# EAGLE design SPARC Project Gamma_Schematic (EAGLE 9.6.2)
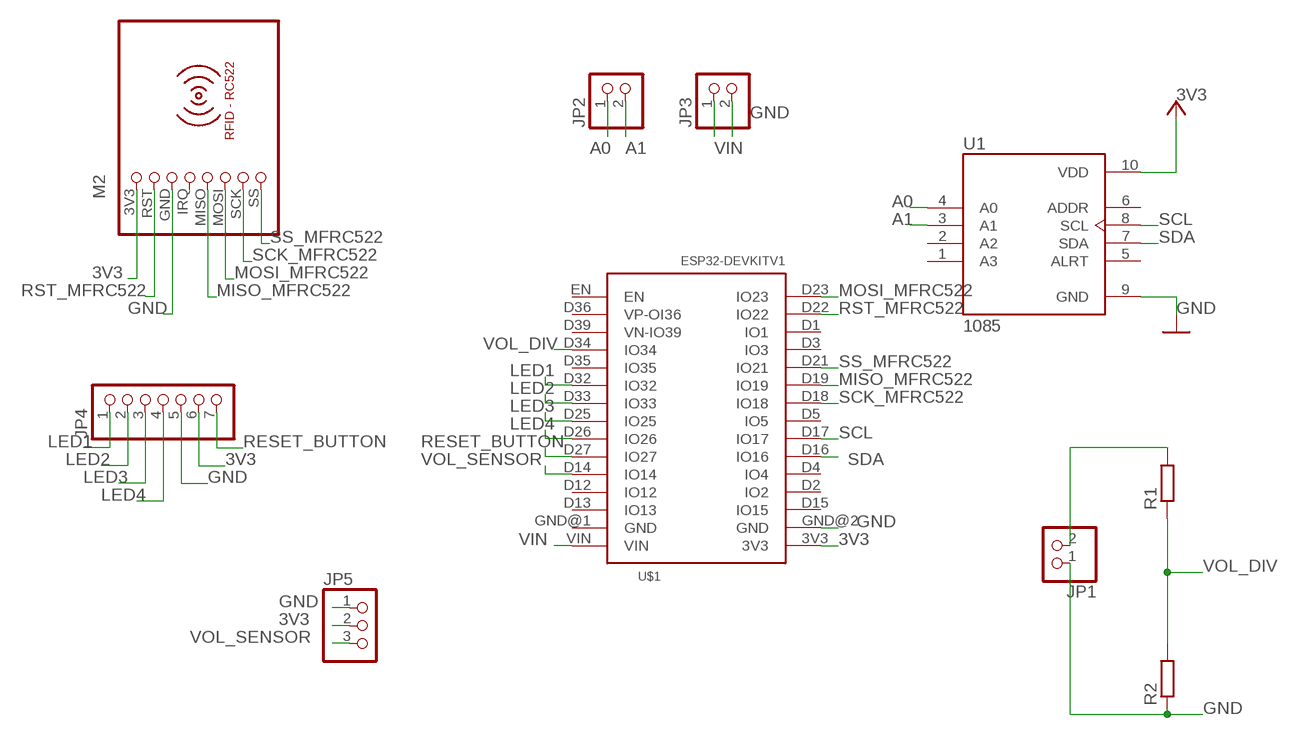
[diagram p0: schematic, sheet 1]

## Parts
JP1  PINHD-1X2  [1X02]
JP2  PINHD-1X2  [1X02]
JP3  PINHD-1X2  [1X02]
JP4  PINHD-1X7  [1X07]
JP5  PINHD-1X3  [1X03]
M2  RFID-RC522  [RFID-RC522]
R1  R-EU_0204/2V  [0204V]
R2  R-EU_0204/2V  [0204V]
U1  1085  [MODULE_1085]
U$1  ESP32DEVKITV1  [ESP32-DEVKITV1]

## Nets
3V3: JP4.6 JP5.2 M2.3V3 U1.10(VDD) U$1.3V3 ; supply symbol labelled +3V3
A0: JP2.1 U1.4(A0)
A1: JP2.2 U1.3(A1)
GND: JP1.1 JP3.2 JP4.5 JP5.1 M2.GND R2.1 U1.9(GND) U$1.GND@2(GND)
LED1: JP4.1 U$1.D32(IO32)
LED2: JP4.2 U$1.D33(IO33)
LED3: JP4.3 U$1.D25(IO25)
LED4: JP4.4 U$1.D26(IO26)
MISO_MFRC522: M2.MISO U$1.D19(IO19)
MOSI_MFRC522: M2.MOSI U$1.D23(IO23)
N$1: JP1.2 R1.2
RESET_BUTTON: JP4.7 U$1.D27(IO27)
RST_MFRC522: M2.RST U$1.D22(IO22)
SCK_MFRC522: M2.SCK U$1.D18(IO18)
SCL: U1.8(SCL) U$1.D17(IO17)
SDA: U1.7(SDA) U$1.D16(IO16)
SS_MFRC522: M2.SS U$1.D21(IO21)
VIN: JP3.1 U$1.VIN
VOL_DIV: R1.1 R2.2 U$1.D34(IO34)
VOL_SENSOR: JP5.3 U$1.D14(IO14)
Unconnected: M2.IRQ U1.1(A3) U1.2(A2) U1.5(ALRT) U1.6(ADDR) U$1.D1(IO1) U$1.D2(IO2) U$1.D3(IO3) U$1.D4(IO4) U$1.D5(IO5) U$1.D12(IO12) U$1.D13(IO13) U$1.D15(IO15) U$1.D35(IO35) U$1.D36(VP-OI36) U$1.D39(VN-IO39) U$1.EN U$1.GND@1(GND)

## Library data of the parts
JP1-JP3 = pinhead:PINHD-1X2: PIN HEADER
JP4 = pinhead:PINHD-1X7: PIN HEADER
JP5 = pinhead:PINHD-1X3: PIN HEADER
M2 = mfrc522-module:RFID-RC522: RFID-RC522 MFRC-522 based breakout board
R1 R2 = resistor:R-EU_: RESISTOR, European symbol
U1 = ads1115:1085: ADS1115 - 16 Bit 860 Samples per Second Analog to Digital Converter (ADC) Evaluation Board Check availability <https://pricing.snapeda.com/parts/1085/Adafruit%20Industries/view-part?ref=eda>; AVAILABILITY: In Stock; CHECK_PRICES: https://www.snapeda.com/parts/1085/Adafruit+Industries+LLC/view-part/?ref=eda; DESCRIPTION: ADS1115 series 16 Bit 860 Samples per Second Analog to Digital Converter (ADC) Evaluation Board; MF: Adafruit Industries; MP: 1085; PACKAGE: NON STANDARD-16 Adafruit; PRICE: None; SNAPEDA_LINK: https://www.snapeda.com/parts/1085/Adafruit+Industries+LLC/view-part/?ref=snap
U$1 = ESP32-DEVKITV1:ESP32DEVKITV1

## Board
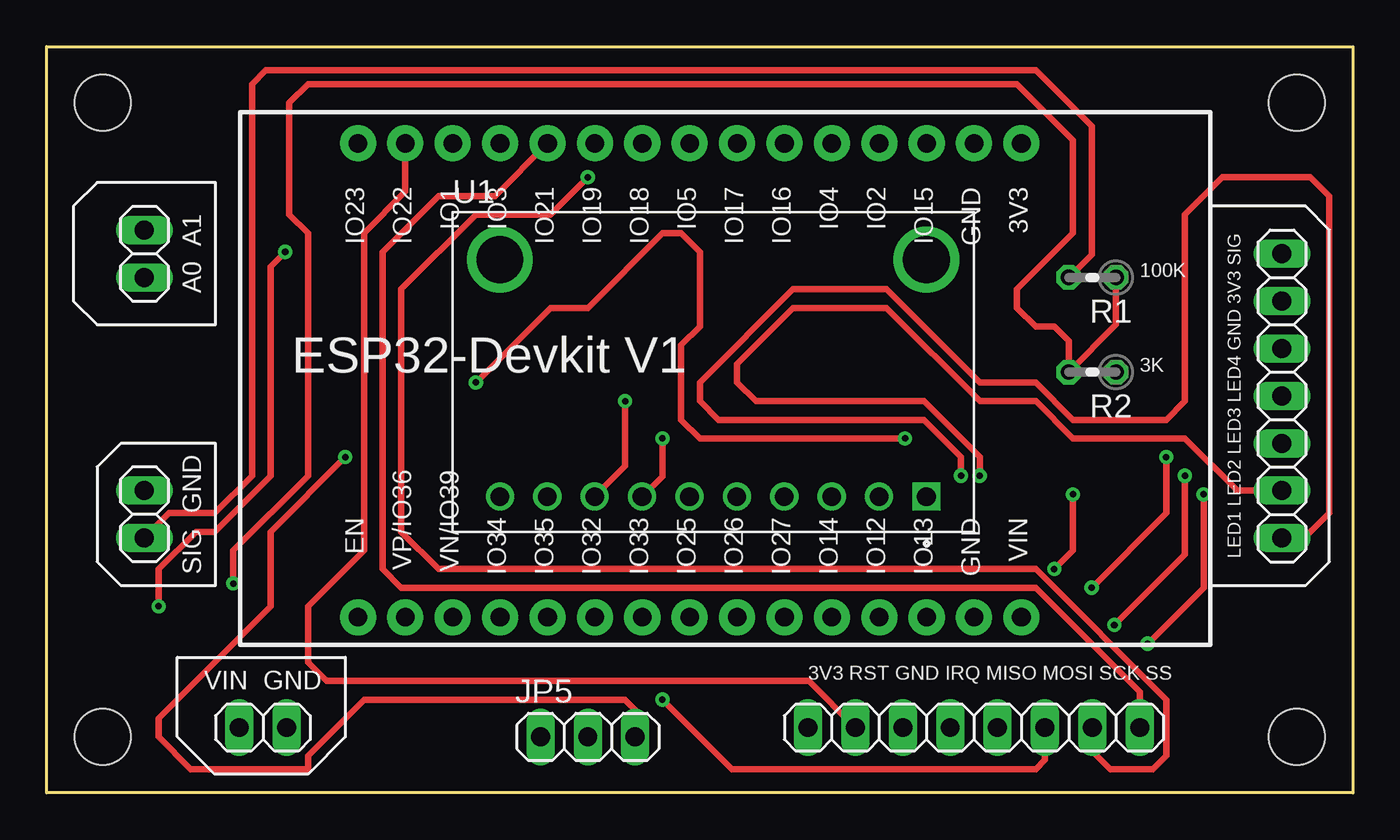
[diagram p1: board, top side]
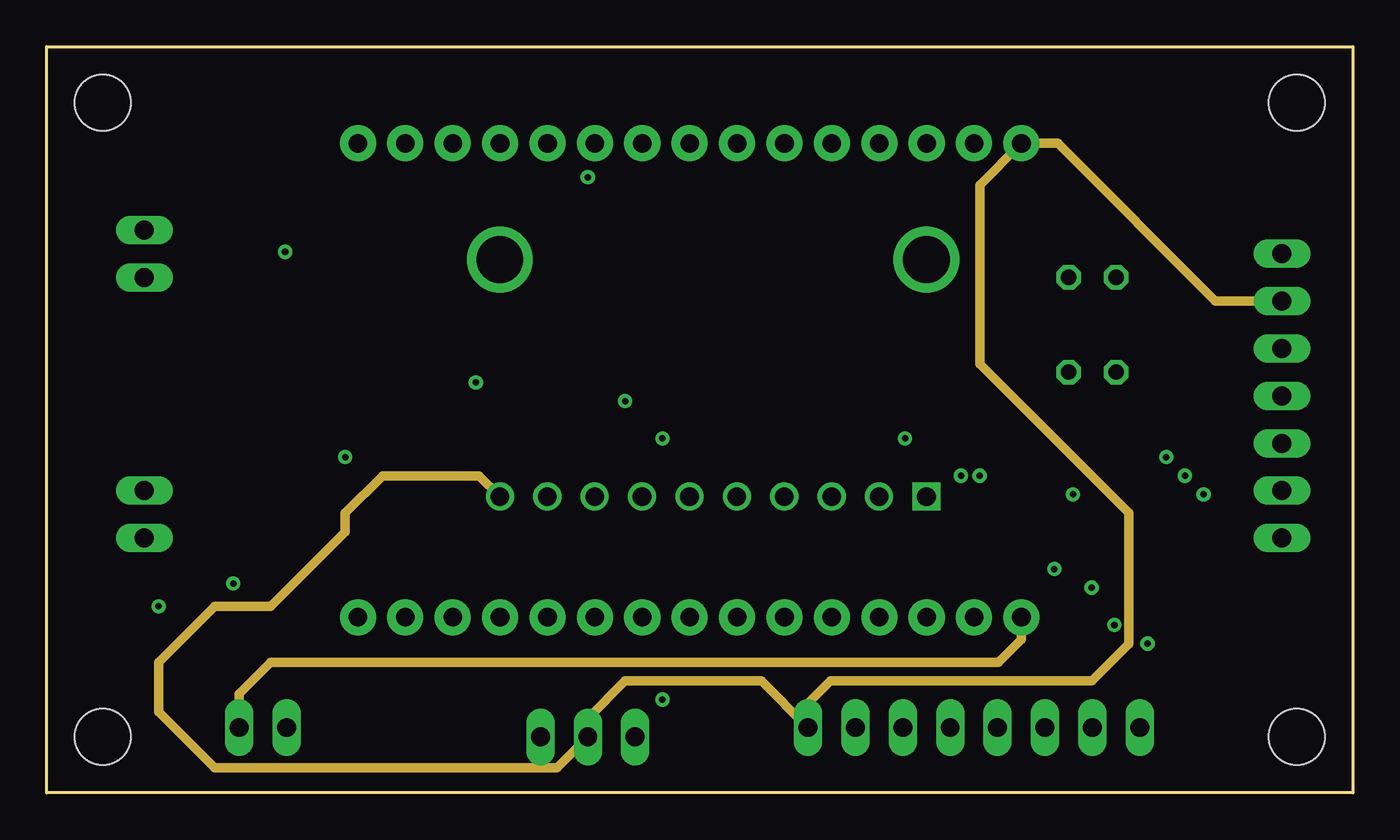
[diagram p2: board, inner layer Route2]
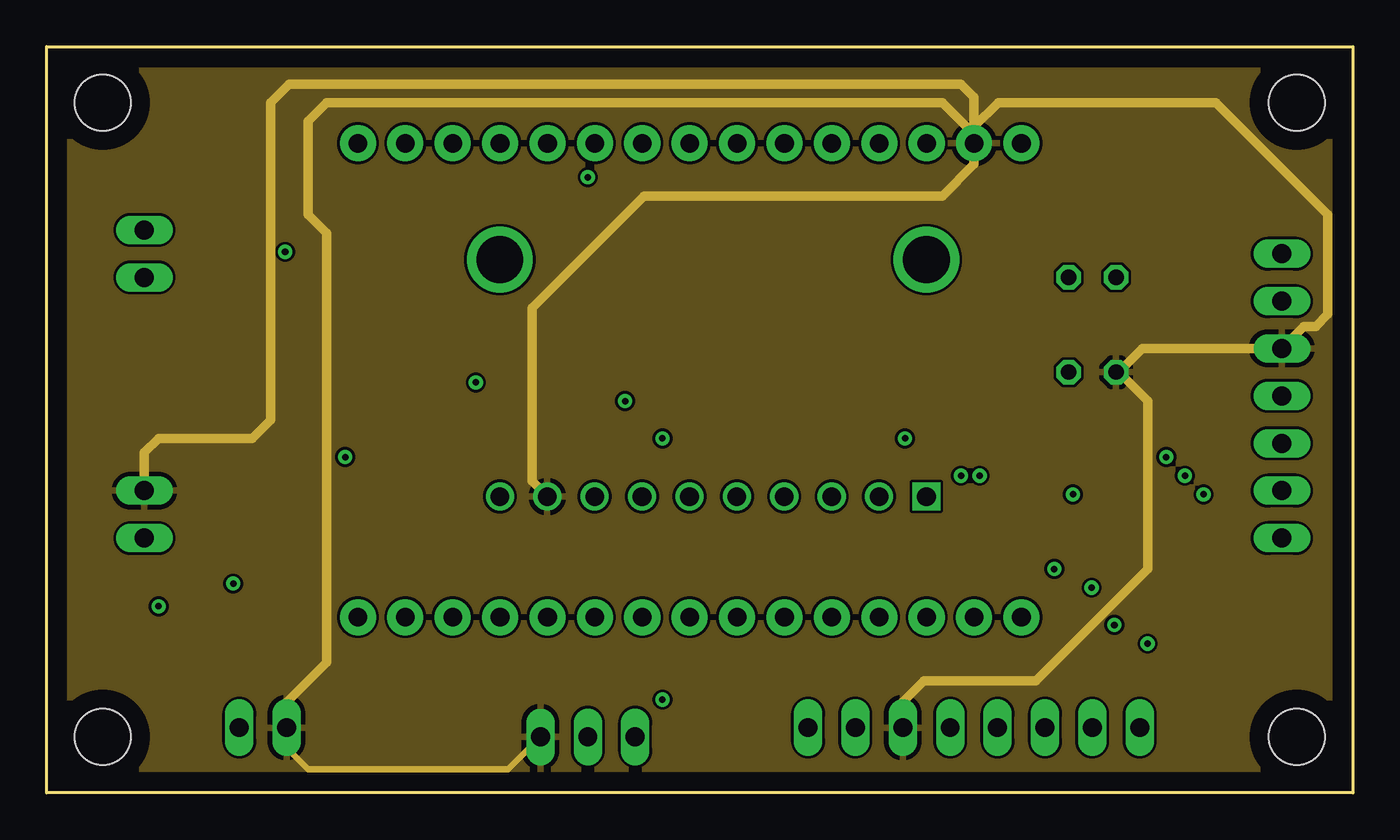
[diagram p3: board, inner layer Route15]
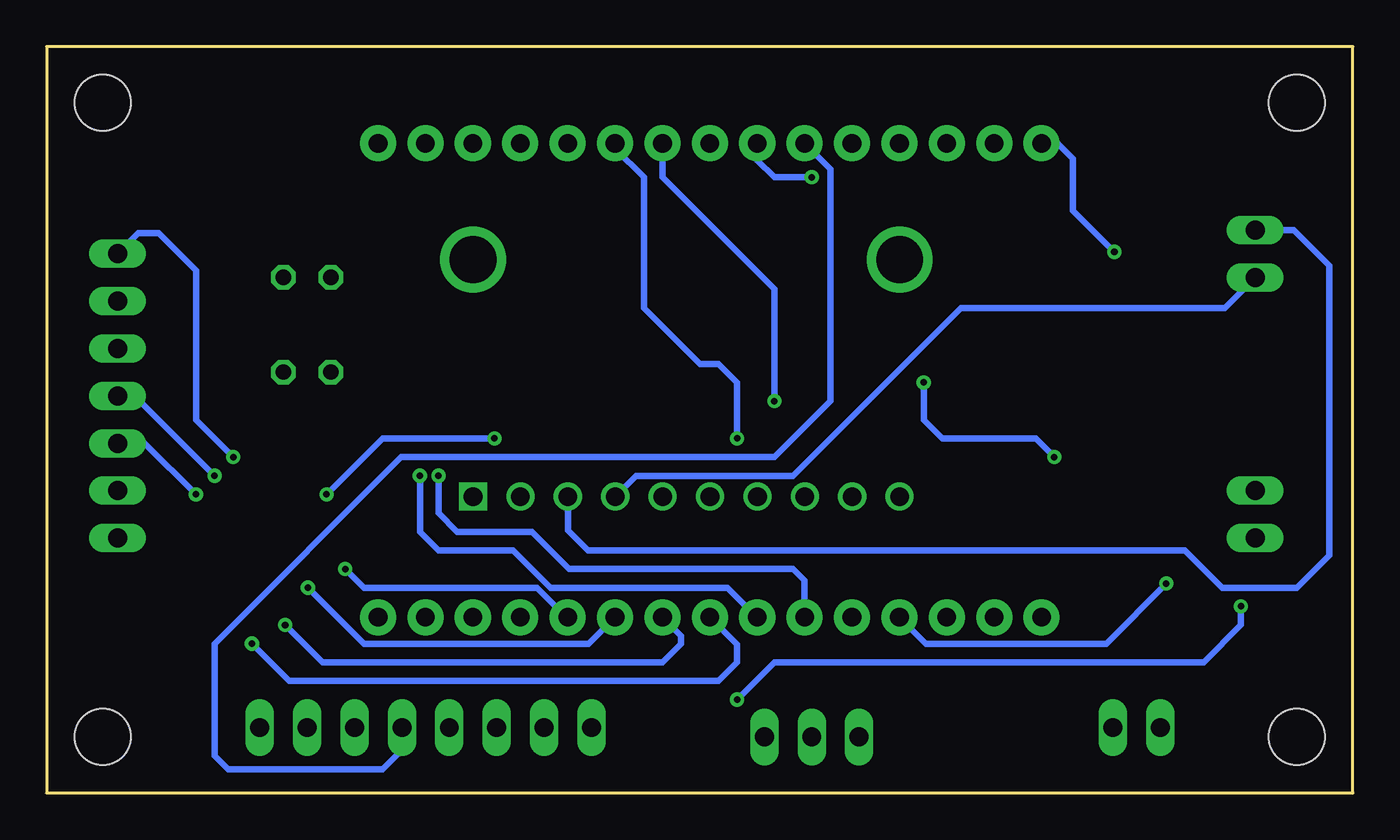
[diagram p4: board, bottom side, seen from below]

Size 70 x 40 mm. Coordinates in mm from the lower left corner, seen from the top.
Outline: 0,40 70,40 70,0 0,0 0,40
Copper layers (1+2*15+16): Top 0.035mm / dielectric 1.5mm / Route2 0.035mm / dielectric 0.15mm / Route15 0.035mm / dielectric 0.2mm / Bottom 0.035mm
Design rules "default *": minimum track width 6mil, minimum drill 0.35mm, track to track 6mil, track to pad 6mil, pad to pad 6mil, via to via 6mil, smd to smd 6mil, copper to edge 40mil, drill to drill 6mil, minimum pad ring 10mil, minimum via ring 8mil, stop-mask expansion 4mil, vias tented up to drill 0mil, thermal gap 10mil
Holes 3 mm at 3,37 3,3 67,37 67,3

### Footprints (pad centres in the part's own frame; a part is rotated, then mirrored left to right if it is on the bottom)
1X02 = drill 1.016 long: 1 -1.27,0; 2 1.27,0
1X07 = drill 1.016 long: 1 -7.62,0; 2 -5.08,0; 3 -2.54,0; 4 0,0; 5 2.54,0; 6 5.08,0; 7 7.62,0
1X03 = drill 1.016 long: 1 -2.54,0; 2 0,0; 3 2.54,0
RFID-RC522 = drill 1.016 long: 3V3 -8.89,0; GND -3.81,0; IRQ -1.27,0; MISO 1.27,0; MOSI 3.81,0; RST -6.35,0; SCK 6.35,0; SS 8.89,0
0204V = drill 0.813 octagon: 1 -1.27,0; 2 1.27,0
MODULE_1085 = drill 1 square: 1 11.43,-6.668 | drill 1: 2 8.89,-6.668; 3 6.35,-6.668; 4 3.81,-6.668; 5 1.27,-6.668; 6 -1.27,-6.668; 7 -3.81,-6.668; 8 -6.35,-6.668; 9 -8.89,-6.668; 10 -11.43,-6.668 | drill 2.5: P1 -11.43,6.032; P2 11.43,6.032
ESP32-DEVKITV1 = drill 1 pad 1.93: 3V3 -16.52,-12.27; D1 13.96,-12.27; D2 -8.9,-12.27; D3 11.42,-12.27; D4 -6.36,-12.27; D5 1.26,-12.27; D12 -8.9,13.135; D13 -11.44,13.135; D14 -6.36,13.135; D15 -11.44,-12.27; D16 -3.82,-12.27; D17 -1.28,-12.27; D18 3.8,-12.27; D19 6.34,-12.27; D21 8.88,-12.27; D22 16.5,-12.27; D23 19.04,-12.27; D25 1.26,13.135; D26 -1.28,13.135; D27 -3.82,13.135; D32 6.34,13.135; D33 3.8,13.135; D34 11.42,13.135; D35 8.88,13.135; D36 16.5,13.135; D39 13.96,13.135; EN 19.04,13.135; GND@1 -13.98,13.135; GND@2 -13.98,-12.27; VIN -16.52,13.135

### Placement (x,y rotation side)
JP1  5.24,14.93 270 top
JP2  5.24,28.9 90 top
JP3  11.59,3.5 0 top
JP4  66.2,21.28 90 top
JP5  29,3 0 top
M2  49.69,3.5 0 top
R1  56.04,27.63 180 top
R2  56.04,22.55 180 top
U1  35.72,22.55 0 top
U$1  35.72,22.55 180 top

### Tracks (layer width: path | path; a pad name or v marks a point on that pad's centre or on a via)
3V3
  Route2 0.5: JP4.6 62.64,26.36 54.18,34.82 U$1.3V3 50,32.58 50,23 58,15 58,8 56,6 42,6 40.8,4.8 M2.3V3 38.3,6 31,6 29,4 JP5.2 27.34,1.34 9,1.34 6,4.34 6,7 9,10 12,10 16,14 16,15 18,17 23.17,17 U1.10
A0
  Bottom 0.36: JP2.1 6.87,26 21,26 30,17 38.41,17 U1.4
A1
  Bottom 0.36: JP2.2 3.17,30.17 1.27,28.27 1.27,12.73 3,11 7,11 9,13 41,13 42.07,14.07 U1.3
GND
  Route15 0.36: JP5.1 24.73,1.27 14,1.27 12.86,2.41 12.86,4
  Route15 0.5: JP3.2 12.86,4 12.86,4.86 15,7 15,30 14,31 14,36 15,37 48,37 49.7,35.3 | 49.7,35.3 U$1.GND@2 | JP1.1 5.24,18.24 6,19 11,19 12,20 12,37 13,38 49,38 49.7,37.3 49.7,35.3 | M2.GND 45.88,4.88 47,6 53,6 59,12 59,21 57.45,22.55 | 57.45,22.55 R2.1 | 57.45,22.55 58.72,23.82 JP4.5 67.38,25 68,25 68.66,25.66 68.66,31 62.66,37 51,37 49.7,35.7 U$1.GND@2 | U1.9 26,16.71 26,26 32,32 48,32 49.7,33.7 U$1.GND@2
  pour Route15: 0,40 70,40 70,0 0,0
LED1  (via drill 0.35)
  Top 0.36: v49,17 49,18 47,20 36,20 35,21 35,22 40,27 45,27 50,22 53,22 55,20 60,20 61,21 61,31 63,33 67.73,33 68.73,32 68.73,15 67.39,13.66 JP4.1
  Bottom 0.36: U$1.D32 29.38,11.38 30,12 42,12 44,14 48,14 49,15 v49,17
LED2  (via drill 0.35)
  Top 0.36: v50,17 50,18 47,21 38,21 37,22 37,23 40,26 45,26 50,21 53,21 55,19 61,19 63.8,16.2 JP4.2
  Bottom 0.36: U$1.D33 33.51,11 43,11 45,13 49,13 50,14 v50,17
LED3  (via drill 0.35)
  Top 0.36: v59,8 62,11 v62,16
  Bottom 0.36: U$1.D25 33,7.95 33,7 34,6 57,6 v59,8 | v62,16 64.74,18.74 JP4.3
LED4  (via drill 0.35)
  Top 0.36: v57.22,9 61,12.78 v61,17
  Bottom 0.36: U$1.D26 36,8.42 36,8 37,7 55.22,7 v57.22,9 | v61,17 65.28,21.28 JP4.4
MISO_MFRC522
  Bottom 0.36: U$1.D19 28,33.44 28,21 31,18 51,18 61,8 61,2 60.27,1.27 52,1.27 50.96,2.31 M2.MISO
MOSI_MFRC522  (via drill 0.35)
  Top 0.36: M2.MOSI 53.5,1.77 53,1.27 36.73,1.27 v33,5 | v6,10 6,12 8,14 9,14 12,17 12,28.22 v12.78,29
  Bottom 0.36: v33,5 31,7 8,7 6,9 v6,10 | v12.78,29 15,31.22 15,34 16,35 16.5,35 U$1.D23
N$1
  Top 0.36: JP1.2 6.58,15 9,15 11,17 11,38 11.73,38.73 53,38.73 56,35.73 56,28.86 R1.2
RESET_BUTTON  (via drill 0.35)
  Top 0.36: v56,11 60,15 v60,18
  Bottom 0.36: U$1.D27 40.95,8 53,8 v56,11 | v60,18 62,20 62,28 64,30 65.1,30 JP4.7
RST_MFRC522
  Top 0.36: U$1.D22 19.22,32.22 17,30 17,13 14,10 14,7 15,6 40.84,6 M2.RST
SCK_MFRC522  (via drill 0.35)
  Top 0.36: v29,33 27,31 23,31 19,27 19,14 21,12 53,12 60,5 60,2 59.27,1.27 57,1.27 56.04,2.23 M2.SCK
  Bottom 0.36: U$1.D18 31.92,33.92 31,33 v29,33
SCL  (via drill 0.35)
  Top 0.36: v31,21 31,17.51 U1.8
  Bottom 0.36: U$1.D17 37,33 31,27 v31,21
SDA  (via drill 0.35)
  Top 0.36: v33,19 33,16.97 U1.7
  Bottom 0.36: U$1.D16 39.54,34.54 38,33 38,26 35,23 34,23 33,22 v33,19
SS_MFRC522
  Top 0.36: U$1.D21 24.02,32 21,32 18,29 18,12 19,11 53,11 58.58,5.42 M2.SS
VIN
  Route2 0.5: JP3.1 10.32,5.32 12,7 51,7 52.24,8.24 U$1.VIN
VOL_DIV  (via drill 0.35)
  Top 0.36: R1.1 57.31,25.09 R2.2 54.77,24.23 54,25 53,25 52,26 52,27 55,30 55,35 52,38 14,38 13,37 13,31 14,30 14,17 10,13 v10,11.22
  Bottom 0.36: U$1.D34 22.88,8 13.22,8 v10,11.22
VOL_SENSOR  (via drill 0.35)
  Top 0.36: JP5.3 31.54,4.46 31,5 17,5 14,2 14,1.27 7.73,1.27 6,3 6,4 12,10 12,14 v16,18 | v23,22 27,26 29,26 33,30 34,30 35,29 35,25 34,24 34,20 35,19 v46,19 | v55,16 55,13 v54,12
  Bottom 0.36: v16,18 17,19 22,19 23,20 v23,22 | v55,16 52,19 v46,19 | v54,12 53,11 47,11 43.73,11 42.86,10.14 42.14,9.42 U$1.D14

### Text on the board
tPlace: A0 A1 | 100K | 3K | LED1 LED2 LED3 LED4 GND 3V3 SIG | SIG GND | VIN GND | 3V3 RST GND IRQ MISO MOSI SCK SS